# Altium schematic sheet DDS_DAC.SchDoc: **
size A4; Author: **; CompanyName: Introducción al Diseño de Circuitos Impresos; Organization: UTN FRBA; Revision: **
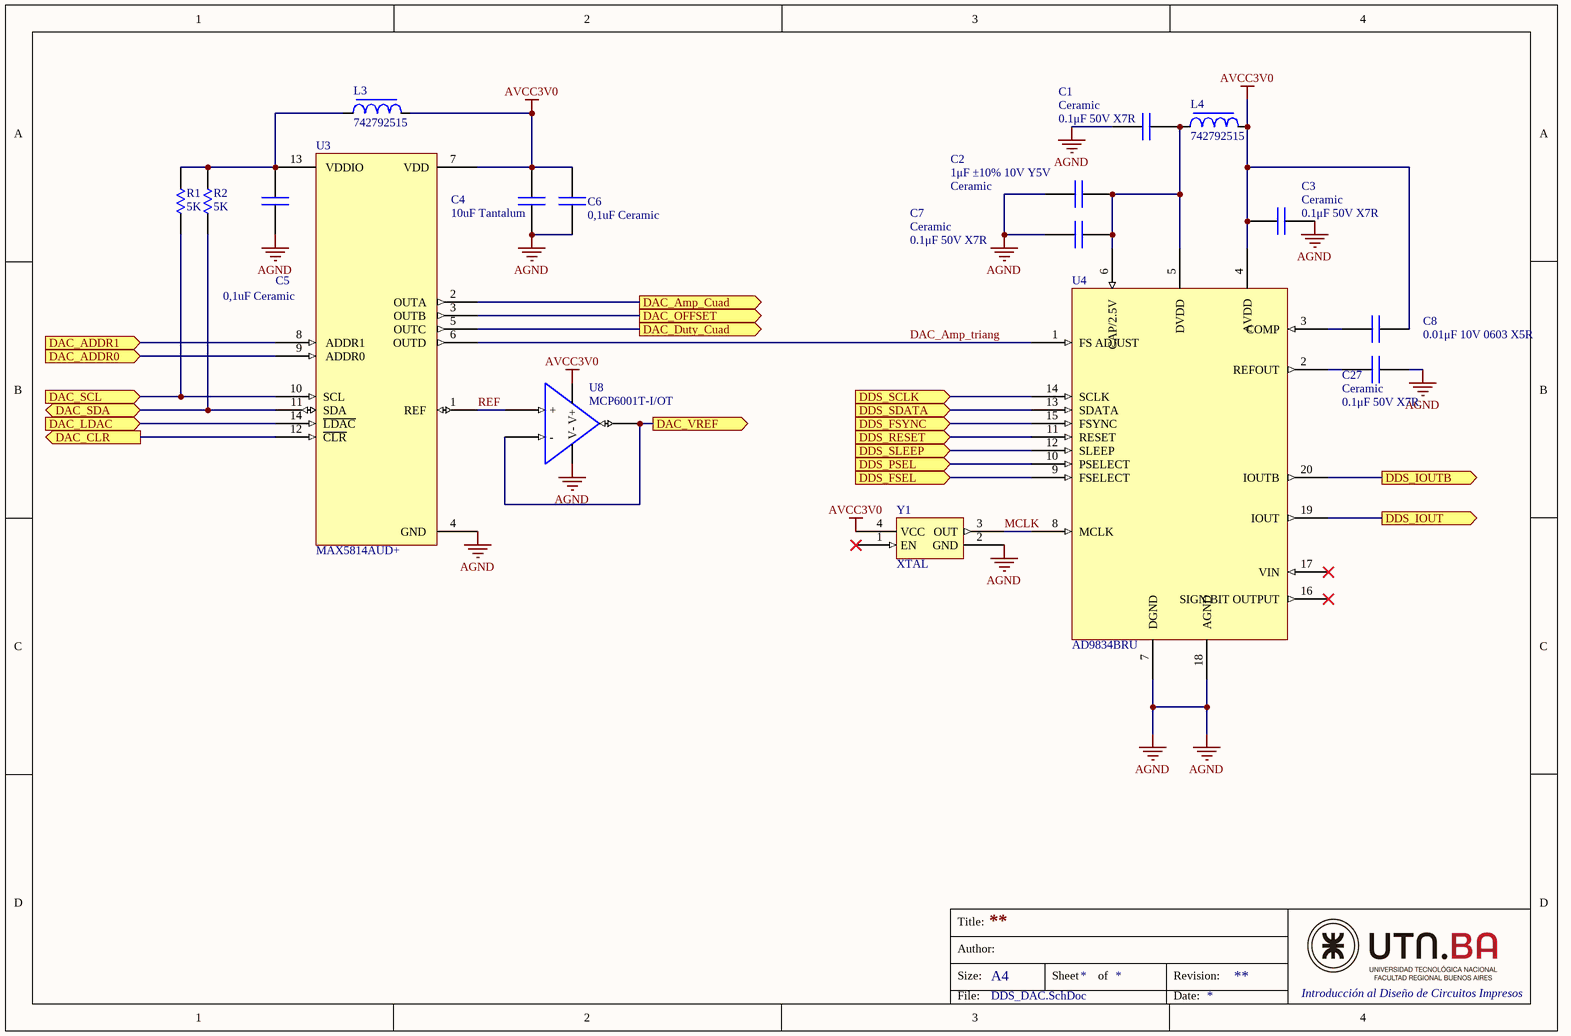
[diagram p0: DDS_DAC.SchDoc]

## Parts
C1  0.1μF 50V X7R  Type: Ceramic  [C_0805]
C2  1μF ±10% 10V Y5V  Type: Ceramic  [C_0805]
C3  0.1μF 50V X7R  Type: Ceramic  [C_0805]
C4  10uF Tantalum  [C_0805]
C5  0,1uF Ceramic  [C_0805]
C6  0,1uF Ceramic  [C_0805]
C7  0.1μF 50V X7R  Type: Ceramic  [C_0805]
C8  0.01μF 10V 0603 X5R  [C_0805]
C27  0.1μF 50V X7R  Type: Ceramic  [C_0805]
L3  742792515  [L_1812]
L4  742792515  [L_1812]
R1  5K  [R_0805]
R2  5K  [R_0805]
U3  MAX5814AUD+
U4  AD9834BRU  [TSSOP_20]
U8  MCP6001T-I/OT  [SOT_23]
Y1  XTAL  [XTAL_4]

## Ports
DAC_ADDR0 (in), DAC_ADDR1 (in), DAC_Amp_Cuad (out), DAC_CLR (out), DAC_Duty_Cuad (out), DAC_LDAC (in), DAC_OFFSET (out), DAC_SCL (in), DAC_SDA (bidir), DAC_VREF (out), DDS_FSEL (in), DDS_FSYNC (in), DDS_IOUT (out), DDS_IOUTB (out), DDS_PSEL (in), DDS_RESET (in), DDS_SCLK (in), DDS_SDATA (in), DDS_SLEEP (in)

## Nets
AGND: C1.1 C2.1 C3.2 C4.2 C5.2 C6.2 C7.1 C27.2 U3.4(GND) U4.7(DGND) U4.18(AGND) U8.2(V-) Y1.2(GND)
AVCC3V0: C3.1 C4.1 C6.1 C8.1 L3.2 L4.2 U3.7(VDD) U4.4(AVDD) U8.5(V+) Y1.4(VCC)
DAC_ADDR0: U3.9(ADDR0) ; port DAC_ADDR0
DAC_ADDR1: U3.8(ADDR1) ; port DAC_ADDR1
DAC_Amp_Cuad: U3.2(OUTA) ; port DAC_Amp_Cuad
DAC_Amp_triang: U3.6(OUTD) U4.1(FS_ADJUST)
DAC_CLR: U3.12(~{CLR}) ; port DAC_CLR
DAC_Duty_Cuad: U3.5(OUTC) ; port DAC_Duty_Cuad
DAC_LDAC: U3.14(~{LDAC}) ; port DAC_LDAC
DAC_OFFSET: U3.3(OUTB) ; port DAC_OFFSET
DAC_SCL: R1.1 U3.10(SCL) ; port DAC_SCL
DAC_SDA: R2.1 U3.11(SDA) ; port DAC_SDA
DAC_VREF: U8.1(Vout) U8.4(-) ; port DAC_VREF
DDS_FSEL: U4.9(FSELECT) ; port DDS_FSEL
DDS_FSYNC: U4.15(FSYNC) ; port DDS_FSYNC
DDS_IOUT: U4.19(IOUT) ; port DDS_IOUT
DDS_IOUTB: U4.20(IOUTB) ; port DDS_IOUTB
DDS_PSEL: U4.10(PSELECT) ; port DDS_PSEL
DDS_RESET: U4.11(RESET) ; port DDS_RESET
DDS_SCLK: U4.14(SCLK) ; port DDS_SCLK
DDS_SDATA: U4.13(SDATA) ; port DDS_SDATA
DDS_SLEEP: U4.12(SLEEP) ; port DDS_SLEEP
MCLK: U4.8(MCLK) Y1.3(OUT)
REF: U3.1(REF) U8.3(+)
NetC1_2: C1.2 C2.2 C7.2 L4.1 U4.5(DVDD) U4.6(CAP/2.5V)
NetC5_1: C5.1 L3.1 R1.2 R2.2 U3.13(VDDIO)
NetC8_2: C8.2 U4.3(COMP)
NetC27_1: C27.1 U4.2(REFOUT)

Not connected (* = marked no-connect by the designer): U4 16(SIGN_BIT_OUTPUT)* 17(VIN)*; Y1 1(EN)*

## Notes on the sheet
- Title:
- Size:
- Author:
- A4
- Sheet
- of
- Revision:
- File:
- Date:

## Library data of the parts
C1-C8 C27 = Cap: Capacitor
L3 L4 = Ferrite: Ferrite Bead
R1 R2 = Res: Resistor
U3 = DAC_14Leads: DAC x4 I2C
U4 = DDS: DDS 50MHz
U8 = OpAmp
Y1 = XTAL: Crystal oscillator